# Altium schematic sheet Jetson_power.SchDoc
size A; SheetNumber: 4; SheetTotal: 4
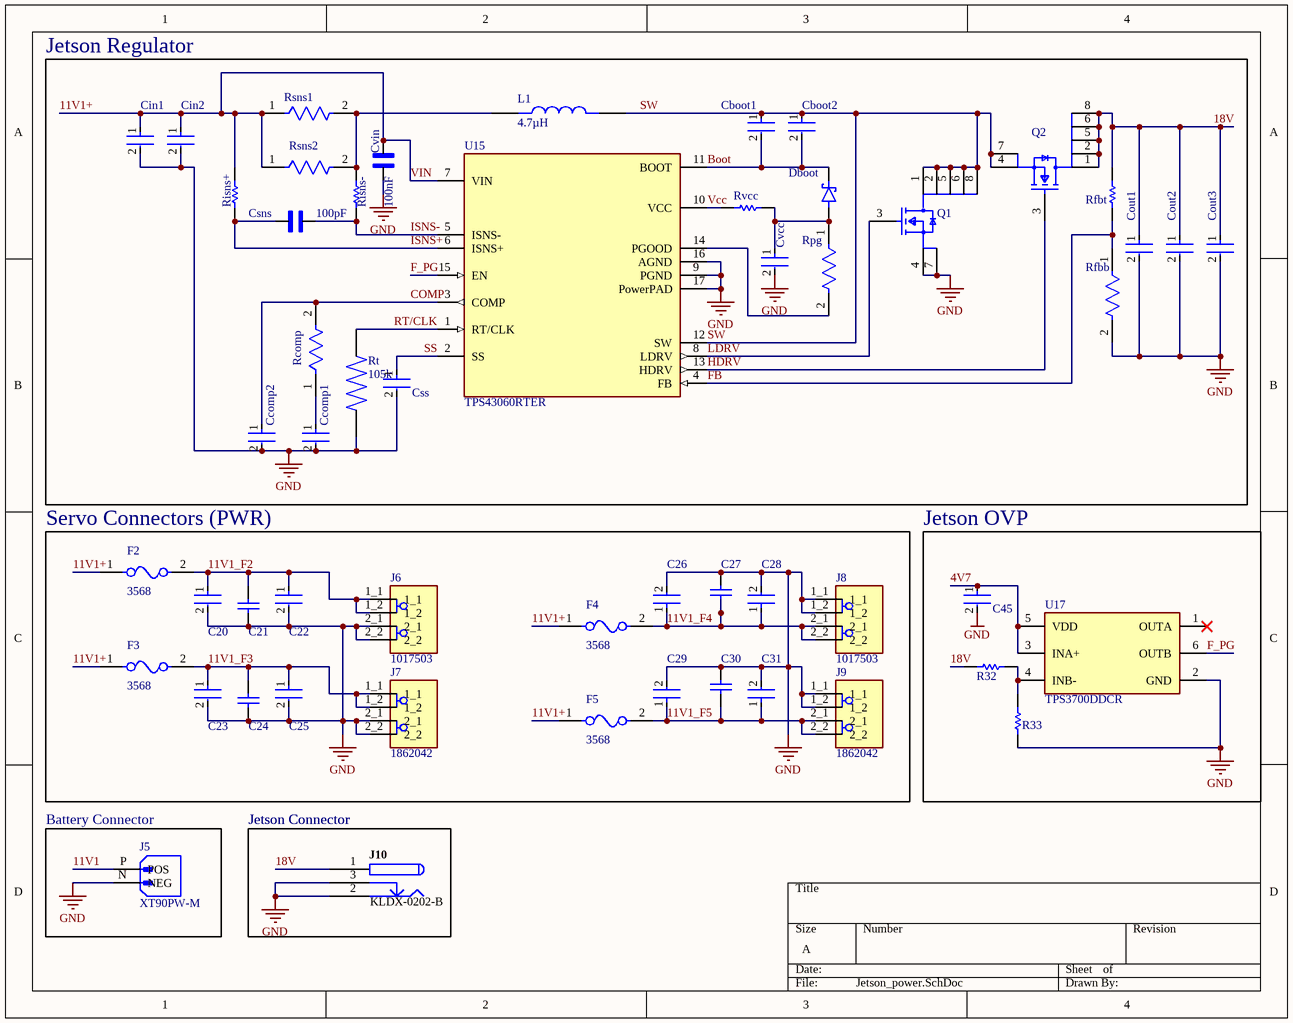
[diagram p0: Jetson_power.SchDoc]

## Parts
C20  CL32A106KBJNNNE  [FP-CL32-IPC_B]  (value not drawn)
C21  C0805C105K5RACTU  [CAPC2013X140X50ML20T25]  (value not drawn)
C22  CC0805KRX7R9BB104  [FP-CC0805-0_85-MFG]  (value not drawn)
C23  CL32A106KBJNNNE  [FP-CL32-IPC_B]  (value not drawn)
C24  C0805C105K5RACTU  [CAPC2013X140X50ML20T25]  (value not drawn)
C25  CC0805KRX7R9BB104  [FP-CC0805-0_85-MFG]  (value not drawn)
C26  CL32A106KBJNNNE  [FP-CL32-IPC_B]  (value not drawn)
C27  C0805C105K5RACTU  [CAPC2013X140X50ML20T25]  (value not drawn)
C28  CC0805KRX7R9BB104  [FP-CC0805-0_85-MFG]  (value not drawn)
C29  CL32A106KBJNNNE  [FP-CL32-IPC_B]  (value not drawn)
C30  C0805C105K5RACTU  [CAPC2013X140X50ML20T25]  (value not drawn)
C31  CC0805KRX7R9BB104  [FP-CC0805-0_85-MFG]  (value not drawn)
C45  GRM155R71H104KE14D  [FP-GRM155-0_05-IPC_B]  (value not drawn)
Cboot1  CC0805KRX7R9BB104  [FP-CC0805-0_85-MFG]  (value not drawn)
Cboot2  CC0805KRX7R9BB104  [FP-CC0805-0_85-MFG]  (value not drawn)
Ccomp1  CGA4C2C0G1H822J060AA  [FP-CGA4J-IPC_A]  (value not drawn)
Ccomp2  GRM1555C1H391JA01J  [FP-GRM155-0_05-IPC_A]  (value not drawn)
Cin1  CL32A106KBJNNNE  [FP-CL32-IPC_B]  (value not drawn)
Cin2  CL32A106KBJNNNE  [FP-CL32-IPC_B]  (value not drawn)
Cout1  CL32B106KBJNNWE  [FP-CL32-IPC_B]  (value not drawn)
Cout2  CL32B106KBJNNWE  [FP-CL32-IPC_B]  (value not drawn)
Cout3  CL32B106KBJNNWE  [FP-CL32-IPC_B]  (value not drawn)
Csns  value 100pF  [CAPC1608X90N]  (hidden comment: GRM1885C1H101JA01D)
Css  GRM155R71H104KE14D  [FP-GRM155-0_05-IPC_B]  (value not drawn)
Cvcc  GRM188R61C106MA73D  [FP-GRM188-0_2-IPC_A]  (value not drawn)
Cvin  value 100nF  [CAPC1005X55N]  (hidden comment: GRM155R71C104KA88D)
Dboot  XBS053V15R-G  [DIO_XBS053V15R-G]  (value not drawn)
F2  3568  [FP-3568-MFG]
F3  3568  [FP-3568-MFG]
F4  3568  [FP-3568-MFG]
F5  3568  [FP-3568-MFG]
J5  XT90PW-M  [AMASS_XT90PW-M - duplicate]
J6  1017503  [PHOENIX_1017503]
J7  1862042  [PHOENIX_1862042]
J8  1017503  [PHOENIX_1017503]
J9  1862042  [PHOENIX_1862042]
J10  KLDX-0202-B  [KYCN-KLDX-0202-B_V]
L1  value 4.7µH  [IND_XAL6060-472MEB]  (hidden comment: XAL6060-472MEB)
Q1  CSD17571Q2  [FP-DQK0006C-MFG]  (value not drawn)
Q2  CSD17571Q2  [FP-DQK0006C-MFG]  (value not drawn)
R32  CRCW0402475KFKED  [RESC1005X40X25LL05T05]  (value not drawn)
R33  CRCW040210K0FKEDHP  [RESC1005X40X25ML05T10]  (value not drawn)
Rcomp  CRCW04025K36FKED  [FP-CRCW0402-e3-IPC_B]  (value not drawn)
Rfbb  CRCW040211K0FKED  [FP-CRCW0402-e3-IPC_A]  (value not drawn)
Rfbt  CRCW0402150KFKED  [RESC1005X40X25NL05T05]  (value not drawn)
Risns+  CRCW040210R0FKED  [RESC1005X40X25NL05T05]  (value not drawn)
Risns-  CRCW040210R0FKED  [RESC1005X40X25NL05T05]  (value not drawn)
Rpg  CRCW0402100KFKED  [FP-CRCW0402-e3-IPC_C]  (value not drawn)
Rsns1  PRL1632-R010-F-T1  [FP-PRL1632-MFG]  (value not drawn)
Rsns2  PRL1632-R010-F-T1  [FP-PRL1632-MFG]  (value not drawn)
Rt  value 105k  [RESC0603X26N]  (hidden comment: RC0201FR-07105KL)
Rvcc  CRCW04022R00FKED  [RESC1005X40X25ML05T05]  (value not drawn)
U15  TPS43060RTER  [FP-RTE0016E-IPC_B]
U17  TPS3700DDCR  [FP-DDC0006A-IPC_A]

## Blocks framed on the sheet
Jetson Regulator: Cboot1 Cboot2 Ccomp1 Ccomp2 Cin1 Cin2 Cout1-Cout3 Csns Css Cvcc Cvin Dboot L1 Q1 Q2 Rcomp Rfbb Rfbt Risns+ Risns- Rpg Rsns1 Rsns2 Rt Rvcc U15
Servo Connectors (PWR): C20-C31 F2-F5 J6-J9
Jetson OVP: C45 R32 R33 U17
Battery Connector: J5

## Nets
GND: C20.2 C21.1 C22.2 C23.2 C24.1 C25.2 C26.2 C27.1 C28.2 C29.2 C30.1 C31.2 C45.2 Ccomp1.2 Ccomp2.2 Cin1.2 Cin2.2 Cout1.2 Cout2.2 Cout3.2 Css.2 Cvcc.2 Cvin.1 J5.N(NEG) J6.2_1 J6.2_2 J7.2_1 J7.2_2 J8.1_1 J8.1_2 J9.1_1 J9.1_2 J10.2 J10.3 Q1.4(S) Q1.7(S) R33.2 Rfbb.2 Rt.2 U15.9(PGND) U15.16(AGND) U15.17(PowerPAD) U17.2(GND)
4V7: C45.1 U17.3(INA+) U17.5(VDD)
11V1: J5.P(POS)
11V1+: Cin1.1 Cin2.1 Cvin.2 F2.1 F3.1 F4.1 F5.1 Risns+.1 Rsns1.1 Rsns2.1 U15.7(VIN)  [also labelled VIN]
11V1_F2: C20.1 C21.2 C22.1 F2.2 J6.1_1 J6.1_2
11V1_F3: C23.1 C24.2 C25.1 F3.2 J7.1_1 J7.1_2
11V1_F4: C26.1 C27.2 C28.1 F4.2 J8.2_1 J8.2_2
11V1_F5: C29.1 C30.2 C31.1 F5.2 J9.2_1 J9.2_2
18V: Cout1.1 Cout2.1 Cout3.1 J10.1 Q2.1(D) Q2.2(D) Q2.5(D) Q2.6(D) Q2.8(D) R32.1 Rfbt.2
Boot: Cboot1.2 Cboot2.2 Dboot.C(K) U15.11(BOOT)
COMP: Ccomp2.1 Rcomp.2 U15.3(COMP)
F_PG: U15.15(EN) U17.6(OUTB)
FB: Rfbb.1 Rfbt.1 U15.4(FB)
HDRV: Q2.3(G) U15.13(HDRV)
ISNS+: Csns.1 Risns+.2 U15.6(ISNS+)
ISNS-: Csns.2 Risns-.1 U15.5(ISNS-)
LDRV: Q1.3(G) U15.8(LDRV)
RT/CLK: Rt.1 U15.1(RT/CLK)
SS: Css.1 U15.2(SS)
SW: Cboot1.1 Cboot2.1 L1.2 Q1.1(D) Q1.2(D) Q1.5(D) Q1.6(D) Q1.8(D) Q2.4(S) Q2.7(S) U15.12(SW)
Vcc: Rvcc.1 U15.10(VCC)
NetCcomp1_1: Ccomp1.1 Rcomp.1
NetCvcc_1: Cvcc.1 Dboot.A Rpg.1 Rvcc.2
NetL1_1: L1.1 Risns-.2 Rsns1.2 Rsns2.2
NetR32_2: R32.2 R33.1 U17.4(INB-)
NetRpg_2: Rpg.2 U15.14(PGOOD)

Not connected (* = marked no-connect by the designer): U17 1(OUTA)*

## Notes on the sheet
- (near J10) Jetson Connector

## Library data of the parts
C20 C23 C26 C29 Cin1 Cin2 = CMP-13271-001337-1: Cap Ceramic 10uF 50V X5R ±10% SMD 1210 +85°C Embossed T/R; Dielectric: X5R; Case Code (Imperial): 1210; Mount: Surface Mount; Depth: 2.5mm; Thickness: 0.106inch; Length: 0.126inch; Voltage Rating: 50V; Min Operating Temperature: -55°C; Case/Package: 1210; Case Code (Metric): 3225; Lead Free: Lead Free; Packaging: Tape and Reel; Width: 0.098inch; Capacitance: 10uF; Voltage Rating (DC): 50V; Max Operating Temperature: 85°C; Tolerance: 10%
C21 C24 C27 C30 = CMP-2007-03236-1: Manufacturer: Kemet; Part Number: C0805C105K5RACTU
C22 C25 C28 C31 = CMP-2100-03606-3: CAP CER 0.1UF 50V X7R 0805; Manufacturer: Yageo; Tolerance: 0.1; Capacitance: 100 nF; Value: 100 nF; Material: Ceramic; Device Class L1: Passive Components; ComponentLink2Description: Datasheet; Package: CC0805-0.85; Manufacturer Part Number: CC0805KRX7R9BB104; Digikey Description: CAP CER 0.1UF 50V X7R 0805; Device Class L3: Ceramic Capacitors; Temperature: -30°C to +85°C; Temperature Characteristic: X7R; Voltage Rating: 50 V; Height: 0.95mm; RoHS: TRUE; Ipc Land Pattern Name: CAPC200125X85; Device Class L2: Capacitors; Category: Cap; Temperature Range Low: -30°C; Temperature Range High: +85°C; Mouser Description: Multilayer Ceramic Capacitors MLCC - SMD/SMT 100nF 50V X7R 10%; Footprint Url: http://www.yageo.com/exep/pages/download/literatures/UPY-C_GEN_24.pdf; Automotive: No; Octopart: https://octopart.com/cc0805krx7r9bb104-yageo-192993; Lead Free: Yes; ComponentLink2URL: http://www.yageo.com/documents/recent/UPY-GPHC_Y5V_6.3V-to-50V_8.pdf
C45 Css = CMP-2008-04639-2: Chip Multilayer Ceramic Capacitors for General Purpose, 0402, 0.10uF, X7R, 15%, 10%, 50V; Dissipation Factor: 0.025%; Capacitance: 100nF; Weight: 0.000212oz; Thickness: 0.022inch; Voltage Rating (DC): 50V; Dielectric Material: Ceramic; Termination: SMD/SMT; Case/Package: 0402; Case Code (Imperial): 0402; Mount: Surface Mount; REACH SVHC: No SVHC; Resistor Type: Ceramic; Dielectric: X7R; Max Operating Temperature: 125°C; Voltage: 50V; Lead Free: Lead Free; Package Quantity: 10000; Packaging: Tape and Reel; Length: 1mm; Material: Ceramic; Height: 0.5mm; Depth: 0.5mm; Width: 0.5mm; Min Operating Temperature: -55°C; Tolerance: 10%; Case Code (Metric): 1005; Voltage Rating: 50V
Cboot1 Cboot2 = CMP-2100-03606-3: CAP CER 0.1UF 50V X7R 0805; Manufacturer: Yageo; Tolerance: 0.1; Capacitance: 100 nF; Value: 100 nF; Device Class L1: Passive Components; ComponentLink2Description: Datasheet; Package: CC0805-0.85; Manufacturer Part Number: CC0805KRX7R9BB104; Digikey Description: CAP CER 0.1UF 50V X7R 0805; Device Class L3: Ceramic Capacitors; Temperature: -30°C to +85°C; Temperature Characteristic: X7R; Voltage Rating: 50 V; Height: 0.95mm; RoHS: TRUE; Ipc Land Pattern Name: CAPC200125X85; Device Class L2: Capacitors; Category: Cap; Temperature Range Low: -30°C; Temperature Range High: +85°C; Material: Ceramic; Mouser Description: Multilayer Ceramic Capacitors MLCC - SMD/SMT 100nF 50V X7R 10%; Footprint Url: http://www.yageo.com/exep/pages/download/literatures/UPY-C_GEN_24.pdf; Automotive: No; Octopart: https://octopart.com/cc0805krx7r9bb104-yageo-192993; Lead Free: Yes; ComponentLink2URL: http://www.yageo.com/documents/recent/UPY-GPHC_Y5V_6.3V-to-50V_8.pdf
Ccomp1 = CMP-08246-000542-1: Cap Ceramic 8.2nF 50V C0G 5% Pad SMD 0805 +125°C Automotive T/R; Capacitance: 8.2nF; Case/Package: 0805; Package Quantity: 1; Weight: 0.000194oz; Voltage Rating (DC): 50V; Composition: Ceramic; Min Operating Temperature: -55°C; Case Code (Metric): 2012; Length: 2mm; Packaging: Tape and Reel; Height: 0.6mm; REACH SVHC: No SVHC; Case Code (Imperial): 0805; Mount: Surface Mount; Voltage Rating: 50V; Dielectric: C0G; Max Operating Temperature: 125°C; Width: 0.049inch; Depth: 1.25mm; Tolerance: 5%; Termination: SMD/SMT; Thickness: 0.028inch; Ratings: AEC-Q200
Ccomp2 = CMP-2008-04006-2: Chip Multilayer Ceramic Capacitors for General Purpose, 0402, 390pF, C0G, 30ppm/°C, 5%, 50V; Termination: SMD/SMT; Max Operating Temperature: 125°C; Voltage: 50V; Packaging: Tape and Reel; Case Code (Imperial): 0402; Voltage Rating (DC): 50V; Case/Package: 0402; Case Code (Metric): 1005; Package Quantity: 1; Capacitance: 390pF; Length: 1mm; Depth: 0.5mm; Mount: Surface Mount; Voltage Rating: 50V; Tolerance: 5%; Min Operating Temperature: -55°C; Dielectric: C0G; Height: 0.5mm; Radiation Hardening: No; Thickness: 0.022inch; Width: 0.02inch
Cout1-Cout3 = CMP-13271-004028-1: Cap Ceramic 10uF 50V X7R ±10% SMD 1210 +125°C Embossed T/R; Dielectric: X7R; Packaging: Tape and Reel; Width: 0.098inch; Case Code (Metric): 3225; Length: 0.126inch; Mount: Surface Mount; Max Operating Temperature: 125°C; Thickness: 0.106inch; Min Operating Temperature: -55°C; Case/Package: 1210; Lead Free: Lead Free; Voltage Rating: 50V; Capacitance: 10uF; Case Code (Imperial): 1210; Package Quantity: 1; Tolerance: 10%
Csns = CMP-001-00083-1: SMD Capacitor C0G(EIA) with Capacitance: 100pF Tol. 5%. Rated Voltage: 50Vdc; MF: Murata Electronics; Source: GRM1885C1H101JA01D.SchLib; MP: GRM1885C1H101JA01D; Component Type: Standard; Pins: 2; Case/Package: 1608 Murata; Design Item ID: GRM1885C1H101JA01D; SnapEDA_Link: https://www.snapeda.com/parts/GRM1885C1H101JA01D/Murata+Electronics+North+America/view-part/?ref=snap; Check_prices: https://www.snapeda.com/parts/GRM1885C1H101JA01D/Murata+Electronics+North+America/view-part/?ref=eda
Cvcc = CMP-2006-02814-2: Chip Multilayer Ceramic Capacitors for General Purpose, 0603, 10uF, X5R, 15%, 20%, 16V; Width: 0.031inch; Case/Package: 0603; Mount: Surface Mount; Capacitance: 10uF; Depth: 0.8mm; REACH SVHC: No SVHC; Lead Free: Lead Free; Tolerance: 20%; Case Code (Imperial): 0603; Voltage Rating: 16V; Height: 0.8mm; Case Code (Metric): 1608; Thickness: 0.031inch; Voltage: 16V; Voltage Rating (DC): 16V; Length: 1.6mm; Max Operating Temperature: 85°C; Dielectric: X5R; Min Operating Temperature: -55°C; Packaging: Tape and Reel; Package Quantity: 4000
Cvin = CMP-001-00084-1: SMD Capacitor X7R(EIA) with Capacitance: 0.10uF Tol. 10%. Rated Voltage: 16Vdc; MF: Murata; Check_prices: https://www.snapeda.com/parts/GRM155R71C104KA88D/Murata/view-part/?ref=eda; Source: GRM155R71C104KA88D.SchLib; Design Item ID: GRM155R71C104KA88D; MP: GRM155R71C104KA88D; Case/Package: 1005-2 Murata; Pins: 2; SnapEDA_Link: https://www.snapeda.com/parts/GRM155R71C104KA88D/Murata/view-part/?ref=snap; Component Type: Standard
Dboot = CMP-004-00031-1: Diode Schottky 20V 500mA Surface Mount SOD-523; MF: Torex; Value: *; Pins: 2; Case/Package: SOD-523 Torex; SnapEDA_Link: https://www.snapeda.com/parts/XBS053V15R-G/Torex/view-part/808826/?ref=snap; Digi-Key_Purchase_URL: https://www.digikey.com/product-detail/en/torex-semiconductor-ltd/XBS053V15R-G/XBS053V15R-G-ND/2765022?utm_source=snapeda&utm_medium=aggregator&utm_campaign=symbol; MP: XBS053V15R-G; Design Item ID: XBS053V15R-G; Source: SnapEDAsch.SchLib; Component Type: Standard; Digi-Key_Part_Number: XBS053V15R-G-ND
F2-F5 = CMP-2000-05464-2: NexarPartId: 8116161; Approvals: UL; Body Material: Nylon; Illumination Type: Illuminated; Voltage Rating (AC): 500V; Current Rating: 20A; Number of Poles: 1; Color: Black; Material: Brass, Nylon, Tin; Depth: 6.73mm; Max Operating Temperature: 145°C; Length: 16mm; Mount: PCB, Vertical; REACH SVHC: No SVHC; Lead Free: Lead Free; Min Operating Temperature: -50°C; Flammability Rating: UL94 V-0; RoHS: Compliant; Orientation: Vertical; Fuse Current: 20A; Termination: PC Pin; Number of Circuits: 1; Contact Plating: Tin; Voltage: 500V; Contact Material: Brass
J5 = XT90PW-M: Socket; DC supply; XT90; male; PIN: 2; on PCBs; THT; Colour: yellow; MF: AMASS; SnapEDA_Link: https://www.snapeda.com/parts/XT90PW-M/AMASS/view-part/?ref=snap; Package: Package; Value: *; MP: XT90PW-M; Check_prices: https://www.snapeda.com/parts/XT90PW-M/AMASS/view-part/?ref=eda
J6 J8 = CMP-033-000000-2: Pin Count: 4; Component Type: Standard; Package: None; Availability: Unavailable; Source: 1017503.SchLib; Design Item ID: 1017503; Value: *; Price: None; MP: 1017503
J7 J9 = CMP-031-000000-2: MF: {'manufacturer': u'Phoenix Contact'}; Availability: Unavailable; Source: 1862042.SchLib; MP: 1862042; Design Item ID: 1862042; Pin Count: 4; Component Type: Standard; Value: *; Package: None; Price: None
J10 = CMP-0256-00001-1: 3 Conductor Power Jack, 2 break 2 aux contacts; ComponentLink2URL: http://anacapa.kycon.com/Catalog_PDF/KLDX_0202.pdf; PackageReference: KLDX-0202-B; Contact Finish: Brass; ComponentLink2Description: Datasheet; Mounting Technology: Through Hole; PackageDescription: Jack, 9 x 14.5 mm Body, 2.5 mm Center Pin Diameter; ComponentLink1Description: Manufacturer URL; PartNumber: KLDX-0202-B; ComponentLink1URL: http://kycon.com/
L1 = CMP-006-00021-1: Power inductor, shielded, 20% tol, SMT, RoHS, halogen-f; MF: Coilcraft; SnapEDA_Link: https://www.snapeda.com/parts/XAL6060-472MEB/Coilcraft/view-part/?ref=snap; Design Item ID: XAL6060-472MEB; Source: XAL6060-472MEB.SchLib; Check_prices: https://www.snapeda.com/parts/XAL6060-472MEB/Coilcraft/view-part/?ref=eda; MP: XAL6060-472MEB; Case/Package: None; Component Type: Standard; Pins: 2
Q1 Q2 = CMP-04962-000062-1: MOSFET N-CH 30V 22A 6SON; Number of Elements: 1; Rise Time: 19ns; Gate to Source Voltage (Vgs): 20V; Turn-On Delay Time: 5.3ns; Input Capacitance: 468pF; Turn-Off Delay Time: 8ns; Power Dissipation: 2.5W; Element Configuration: Single; Fall Time: 26ns; Drain to Source Resistance: 29mR; Contact Plating: Tin; Continuous Drain Current (ID): 22A; Max Operating Temperature: 150°C; Drain to Source Breakdown Voltage: 30V; Number of Channels: 1; Max Power Dissipation: 2.5W; Packaging: Tape and Reel; RoHS Compliant: Yes; Mount: Surface Mount; Lead Free: Lead Free; Min Operating Temperature: -55°C; Package Quantity: 3000; Drain to Source Voltage (Vdss): 30V; Rds On Max: 29mR; Number of Pins: 6
R32 = CMP-2002-00024-1: Manufacturer: Vishay Dale; Part Number: CRCW0402475KFKED
R33 = CMP-2002-03043-1: Manufacturer: Vishay Dale; Part Number: CRCW040210K0FKEDHP
Rcomp = CMP-1011-00593-3: RES Thick Film, 5.36kΩ, 1%, 0.063W, 100ppm/°C, 0402; Voltage Rating: 50V; Resistance: 5.36kR; Max Power Dissipation: 63mW; Temperature Coefficient: 100ppm/°C; Series: CRCW; Number of Terminations: 2; Resistance Tolerance: 1%; Min Operating Temperature: -55°C; Weight: 2.3E-05oz; Case Code (Metric): 1005; Military Standard: Not; Depth: 0.5mm; Contact Plating: Tin; Number of Pins: 2; Length: 1mm; Max Operating Temperature: 155°C; Tolerance: 1%; Voltage Rating (DC): 50V; Case Code (Imperial): 0402; Height: 0.016inch; Packaging: Tape and Reel; Features: Automotive AEC-Q200; RoHS Compliant: Yes; Construction: Rectangular; Power Rating: 63mW; Lead Free: Lead Free; Package Quantity: 10; Radiation Hardening: No; Resistor Type: Thick Film; Case/Package: 0402; Width: 0.5mm
Rfbb = CMP-2002-08157-2: RES Thick Film, 11kΩ, 1%, 0.063W, 100ppm/°C, 0402; Power Rating: 63mW; Voltage Rating (DC): 50V; Resistance: 11kR; Case Code (Imperial): 0402; Features: Automotive AEC-Q200; Lead Free: Lead Free; Contact Plating: Tin; Weight: 2.3E-05oz; Max Power Dissipation: 63mW; Termination: SMD/SMT; Width: 0.02inch; Number of Terminations: 2; Length: 1mm; Height: 0.35mm; Radiation Hardening: No; Tolerance: 1%; Voltage Rating: 50V; Military Standard: Not; Package Quantity: 10; Depth: 0.5mm; Case Code (Metric): 1005; Temperature Coefficient: 100ppm/°C; Number of Pins: 2; Composition: Thick Film; Max Operating Temperature: 155°C; Case/Package: 0402; Packaging: Tape and Reel; Min Operating Temperature: -55°C
Rfbt = CMP-2002-08212-1: Manufacturer: Vishay Dale; Part Number: CRCW0402150KFKED
Risns+ Risns- = CMP-2002-08143-1: Manufacturer: Vishay Dale; Part Number: CRCW040210R0FKED
Rpg = CMP-2002-08123-3: RES Thick Film, 100kΩ, 1%, 0.063W, 100ppm/°C, 0402; Power Rating: 63mW; Resistance: 100kR; Voltage Rating (DC): 50V; Lead Free: Lead Free; Height: 0.35mm; Contact Plating: Tin; Min Operating Temperature: -55°C; Package Quantity: 10000; Case/Package: 0402; Temperature Coefficient: 100ppm/°C; Number of Terminations: 2; Packaging: Tape and Reel; Max Power Dissipation: 63mW; Case Code (Metric): 1005; Mount: Surface Mount; Width: 0.02inch; Termination: SMD/SMT; Length: 1mm; Number of Pins: 2; Weight: 2.3E-05oz; Radiation Hardening: No; Tolerance: 1%; Military Standard: Not; Features: Automotive AEC-Q200; Depth: 0.5mm; Composition: Thick Film; Max Operating Temperature: 155°C; Voltage Rating: 50V; Case Code (Imperial): 0402
Rsns1 Rsns2 = CMP-2003-04764-2: 10 mOhms ±1% 1W Chip Resistor Wide 0612 (1632 Metric), Current Sense Thin Film; Temperature Coefficient: 200ppm/°C; Resistance: 10mR; Power Rating: 1W; Max Power Dissipation: 1W; Resistor Type: Thin Film; Number of Terminations: 2; Case/Package: 1206; Package Quantity: 1000; Lead Free: Lead Free; RoHS Compliant: Yes; Technology: THIN FILM; Case Code (Metric): 3216; Width: 1.6mm; Case Code (Imperial): 1206; Weight: 0.000466oz; Height: 0.5mm; Max Operating Temperature: 125°C; Tolerance: 1%; Min Operating Temperature: -55°C; Length: 3.2mm; Termination: SMD/SMT; Packaging: Cut Tape
Rt = CMP-009-00177-1: 105 kOhms Â±1% 0.05W, 1/20W Chip Resistor 0201 (0603 Metric) Moisture Resistant Thick Film; MF: Yageo; Source: RC0201FR-07105KL.SchLib; Component Type: Standard; MP: RC0201FR-07105KL; Pins: 2; Design Item ID: RC0201FR-07105KL; Check_prices: https://www.snapeda.com/parts/RC0201FR-07105KL/Yageo/view-part/?ref=eda; SnapEDA_Link: https://www.snapeda.com/parts/RC0201FR-07105KL/Yageo/view-part/?ref=snap; Case/Package: SMD-2 Yageo
Rvcc = CMP-2002-08486-1: Manufacturer: Vishay Dale; Part Number: CRCW04022R00FKED
U15 = CMP-04918-000522-1: IC REG CTRLR BOOST 16WQFN; Synchronous Rectifier: Yes; Max Frequency: 1MHz; Number of Output Phases: 1; Output Voltage: 58V; Clock Sync: No; Duty Cycle: 95%; Output Configuration: Positive; Operating Supply Voltage: 7.5V; Max Duty Cycle: 50%; Output Current: 2A; Quiescent Current: 600uA; Package Quantity: 3000; Radiation Hardening: No; Max Operating Temperature: 150°C; Number of Pins: 16; Mount: Surface Mount; RoHS Compliant: Yes; Packaging: Tape and Reel; Number of Outputs: 1; Contact Plating: Gold; Min Operating Temperature: -40°C; Lead Free: Lead Free; Switching Frequency: 1MHz; Topology: Boost
U17 = CMP-1708-00001-5: IC COMP WINDOW W/REF 6SOT; Operating Supply Current: 5.5uA; Min Supply Voltage: 1.8V; Nominal Supply Current: 7uA; Number of Voltages Monitored: 2; Max Supply Voltage: 18V; Undervoltage Threshold: 1.7V; Quiescent Current: 11uA; Watchdog Timer: No; Number of Channels: 1; Hysteresis: 5.5mV; Propagation Delay: 29us; REACH SVHC: No SVHC; Case/Package: SOT; Number of Pins: 6; Mount: Surface Mount; Radiation Hardening: No; Max Operating Temperature: 125°C; Package Quantity: 3000; Min Operating Temperature: -40°C; Packaging: Tape and Reel; Number of Elements: 2; Lead Free: Lead Free